# EAGLE design WindHack (EAGLE 7.7.0)
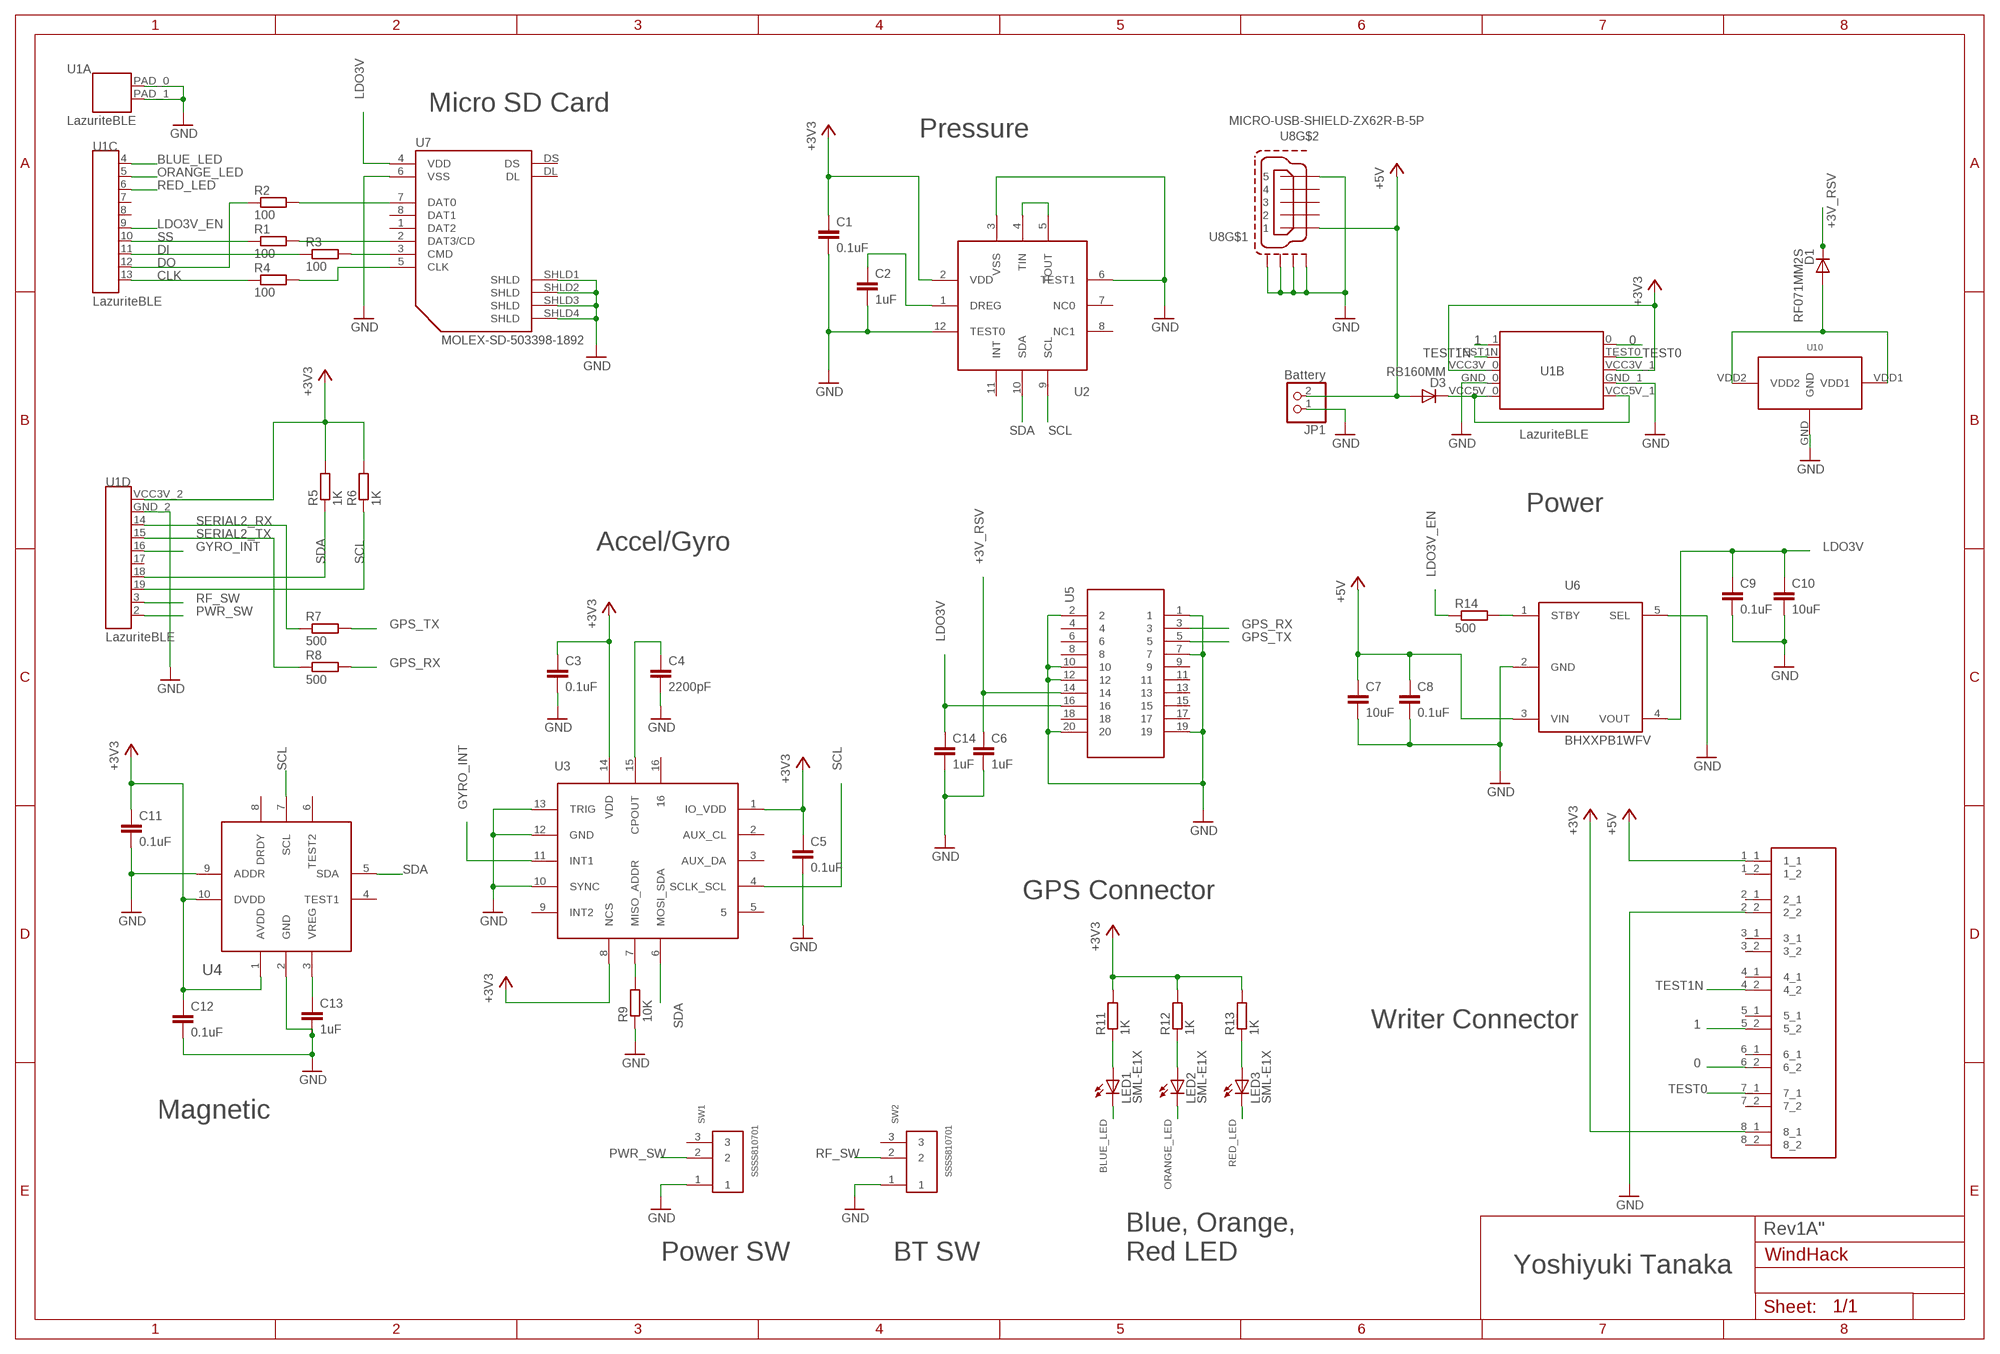
[diagram p0: schematic, sheet 1]

## Parts
C1  0.1uF  C-EUC0603  [C0603]
C2  1uF  C-EUC0603  [C0603]
C3  0.1uF  C-EUC0603  [C0603]
C4  2200pF  C-EUC0603  [C0603]
C5  0.1uF  C-EUC0603  [C0603]
C6  1uF  C-EUC0603  [C0603]
C7  10uF  C-EUC0603  [C0603]
C8  0.1uF  C-EUC0603  [C0603]
C9  0.1uF  C-EUC0603  [C0603]
C10  10uF  C-EUC0603  [C0603]
C11  0.1uF  C-EUC0603  [C0603]
C12  0.1uF  C-EUC0603  [C0603]
C13  1uF  C-EUC0603  [C0603]
C14  1uF  C-EUC0603  [C0603]
D1  RF071MM2S  [RF071MM2S]
D3  RB160MM  [RB160MM-30]
JP1  Battery  PINHD-1X2  [1X02]
LED1  SML-E1X  [SML-E1X]
LED2  SML-E1X  [SML-E1X]
LED3  SML-E1X  [SML-E1X]
R1  100  R-EU_R0603  [R0603]
R2  100  R-EU_R0603  [R0603]
R3  100  R-EU_R0603  [R0603]
R4  100  R-EU_R0603  [R0603]
R5  1K  R-EU_R0603  [R0603]
R6  1K  R-EU_R0603  [R0603]
R7  500  R-EU_R0603  [R0603]
R8  500  R-EU_R0603  [R0603]
R9  10K  R-EU_R0603  [R0603]
R11  1K  R-EU_R0603  [R0603]
R12  1K  R-EU_R0603  [R0603]
R13  1K  R-EU_R0603  [R0603]
R14  500  R-EU_R0603  [R0603]
SW1  SSSS810701  [SSSS810701]
SW2  SSSS810701  [SSSS810701]
U1  LazuriteBLE  LAZURITE920JLAZURITE920J  [LAZURITE920J]
U2  BM1383AGLV  [BM1383AGLV]
U3  KXG03  [KXG03]
U4  BM1422AGMV  [BM1422AGMV]
U5  DF40C-20DS-0.4V  [DF40C-20DS-0.4V]
U6  BHXXPB1WFV  [HVSOF5]
U7  MOLEX-SD-503398-1892  [MOLEX-SD-503398-003]
U8  MICRO-USB-SHIELD-ZX62R-B-5P  [ZX62R-B-5P]
U10  BK-913  [BK-913]
U$1  XB-1-X  [XB-1-X]

## Nets
0: U1.0 U$1.6_2
1: U1.1 U$1.5_2
+3V3: C1.1 C3.1 C5.1 C11.1 C12.1 R5.2 R6.2 R11.2 R12.2 R13.2 U1.VCC3V_0(B:VCC3V_0) U1.VCC3V_1(B:VCC3V_1) U1.VCC3V_2(D:VCC3V_2) U2.2(VDD) U3.1(IO_VDD) U3.8(NCS) U3.14(VDD) U4.1(AVDD) U4.10(DVDD) U$1.8_1
+3V_RSV: C6.1 D1.C U5.14
+5V: C7.1 C8.1 D3.A JP1.2 U6.3(VIN) U8.1 U$1.1_1
BLUE_LED: LED1.C U1.4
CLK: R4.1 U1.13
DI: R3.1 U1.11
DO: R2.1 U1.12
GND: C1.2 C2.2 C3.2 C4.2 C5.2 C6.2 C7.2 C8.2 C9.2 C10.2 C11.2 C12.2 C13.2 C14.2 JP1.1 R9.1 SW1.1 SW2.1 U1.GND_0(B:GND_0) U1.GND_1(B:GND_1) U1.GND_2(D:GND_2) U1.PAD_0(A:PAD_0) U1.PAD_1(A:PAD_1) U2.3(VSS) U2.6(TEST1) U2.12(TEST0) U3.10(SYNC) U3.12(GND) U3.13(TRIG) U4.2(GND) U4.9(ADDR) U5.1 U5.2 U5.7 U5.10 U5.12 U5.19 U5.20 U6.2(GND) U6.5(SEL) U7.6(VSS) U7.SHLD1(SHLD) U7.SHLD2(SHLD) U7.SHLD3(SHLD) U7.SHLD4(SHLD) U8.5 U8.M1(S1) U8.M2(S2) U8.M3(S3) U8.M4(S4) U10.GND U$1.2_2
GPS_RX: R8.2 U5.3
GPS_TX: R7.2 U5.5
GYRO_INT: U1.16 U3.11(INT1)
LDO3V: C9.1 C10.1 C14.1 U5.16 U6.4(VOUT) U7.4(VDD)
LDO3V_EN: R14.1 U1.9
N$1: LED1.A R11.1
N$2: LED2.A R12.1
N$3: U2.4(TIN) U2.5(TOUT)
N$4: LED3.A R13.1
N$5: R9.2 U3.7(MISO_ADDR)
N$6: R14.2 U6.1(STBY)
N$7: C2.1 U2.1(DREG)
N$8: D1.A U10.VDD1 U10.VDD2
N$10: D3.C U1.VCC5V_0(B:VCC5V_0) U1.VCC5V_1(B:VCC5V_1)
N$15: C13.1 U4.3(VREG)
N$16: C4.1 U3.15(CPOUT)
ORANGE_LED: LED2.C U1.5
PWR_SW: SW1.2 U1.2
RED_LED: LED3.C U1.6
RF_SW: SW2.2 U1.3
SCL: R6.1 U1.19 U2.9(SCL) U3.4(SCLK_SCL) U4.7(SCL)
SD_CLK: R4.2 U7.5(CLK)
SD_DI: R3.2 U7.3(CMD)
SD_DO: R2.2 U7.7(DAT0)
SD_SS: R1.2 U7.2(DAT3/CD)
SDA: R5.1 U1.18 U2.10(SDA) U3.6(MOSI_SDA) U4.5(SDA)
SERIAL2_RX: R7.1 U1.14
SERIAL2_TX: R8.1 U1.15
SS: R1.1 U1.10
TEST0: U1.TEST0(B:TEST0) U$1.7_1
TEST1N: U1.TEST1N(B:TEST1N) U$1.4_2
Unconnected: SW1.3 SW2.3 U1.7 U1.8 U1.17 U2.7(NC0) U2.8(NC1) U2.11(INT) U3.2(AUX_CL) U3.3(AUX_DA) U3.5 U3.9(INT2) U3.16 U4.4(TEST1) U4.6(TEST2) U4.8(DRDY) U5.4 U5.6 U5.8 U5.9 U5.11 U5.13 U5.15 U5.17 U5.18 U7.1(DAT2) U7.8(DAT1) U7.DL U7.DS U8.2 U8.3 U8.4 U$1.1_2 U$1.2_1 U$1.3_1 U$1.3_2 U$1.4_1 U$1.5_1 U$1.6_1 U$1.7_2 U$1.8_2

## Notes on the sheet
- Micro SD Card
- Pressure
- Power
- Accel/Gyro
- GPS Connector
- Writer Connector
- Magnetic
- Rev1A''
- Power SW | BT SW
- Blue, Orange, 
  Red LED
- Yoshiyuki Tanaka

## Library data of the parts
C1-C14 = rcl:C-EU: CAPACITOR, European symbol
D1 = lz-shield:RF071MM2S
D3 = lazurite:RB160MM
JP1 = pinhead:PINHD-1X2: PIN HEADER
LED1-LED3 = lazurite:SML-E1X
R1-R9 R11-R14 = rcl:R-EU_: RESISTOR, European symbol
SW1 SW2 = lz-shield:SSSS810701
U1 = lazurite:LAZURITE920J: Lazurite 920J
U2 = lz-shield:BM1383AGLV
U3 = lz-shield:KXG03: Digi-Key品番 1191-1043-1-ND
U4 = lz-shield:BM1422AGMV
U5 = lz-shield:DF40C-20DS-0.4V: Digi-Key品番 H11619CT-ND
U6 = lazurite:BHXXPB1WFV
U7 = molex-custom:MOLEX-SD-503398-1892: Micro SD card holder, push/pull small 8C
U8 = con-hirose:MICRO-USB-SHIELD-: Hirose Micro USB Connector ZX62R-B-5P: Micro B, reverse (top mount) shell SMT Supplier: DigiKey H11574CT-ND Source: http://www.hirose.co.jp/cataloge_hp/e24200011.pdf
U10 = lz-shield:BK-913
U$1 = lz-shield:XB-1-X

## Board
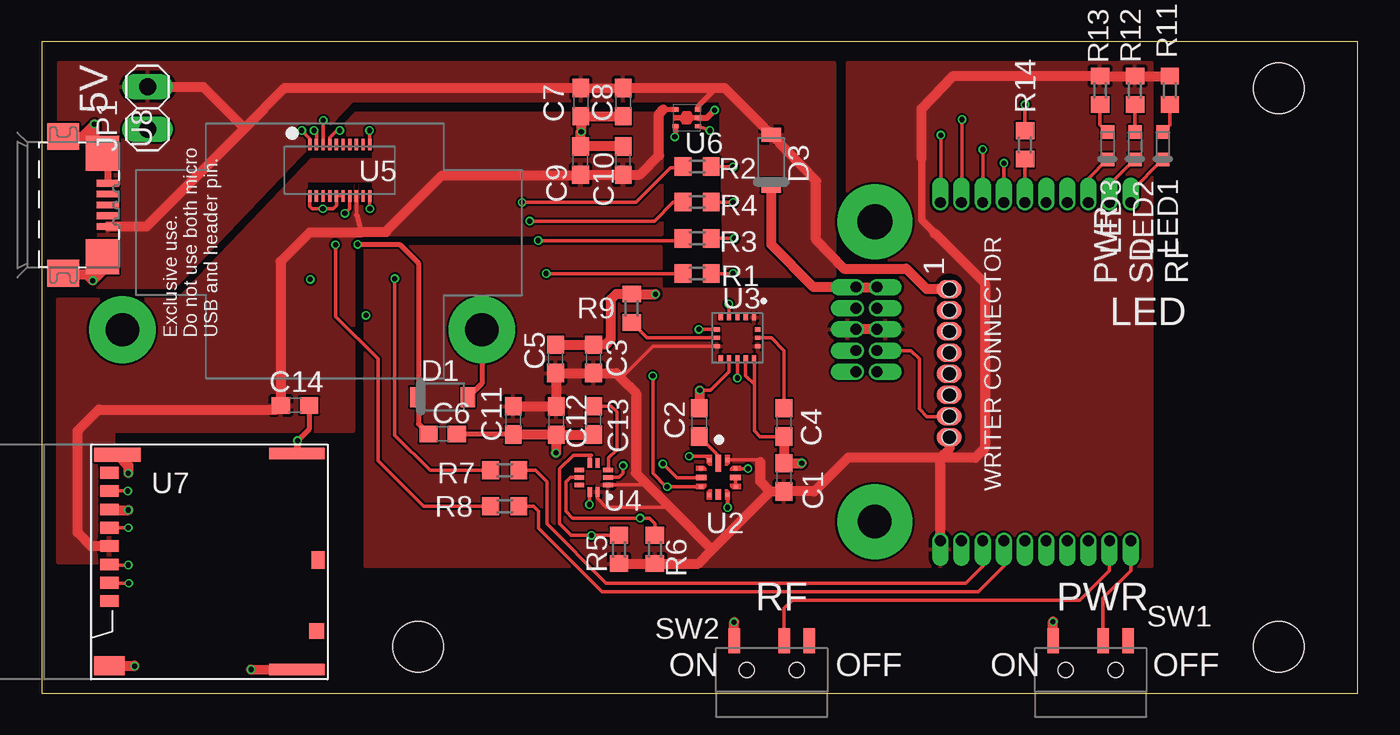
[diagram p1: board, top side]
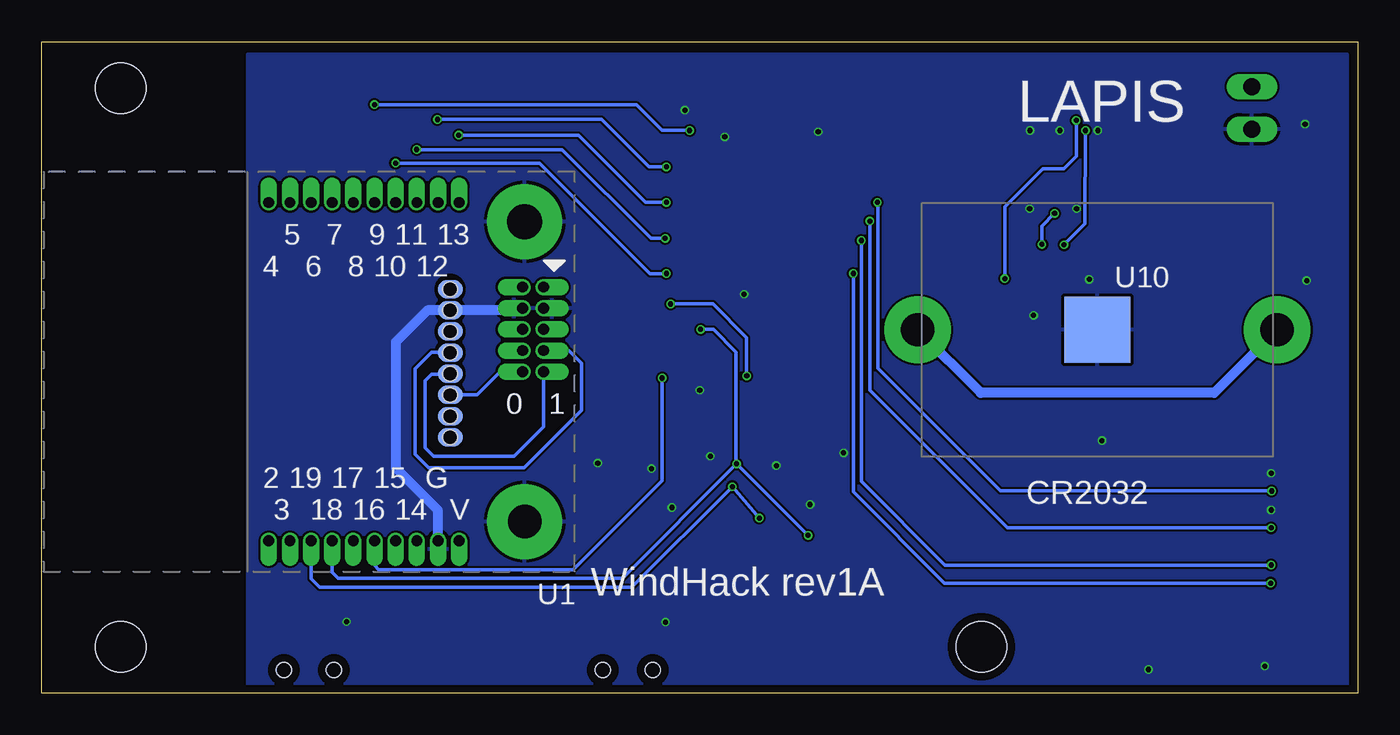
[diagram p2: board, bottom side, seen from below]

Size 79.04 x 39.12 mm. Coordinates in mm from the lower left corner, seen from the top.
Outline: 0,0 79.05,0 79.05,39.12 0,39.12 0,0
Copper layers (1*16): Top 0.018mm / dielectric 1.55mm / Bottom 0.018mm
Design rules "unicraft_2layer": minimum track width 0.125mm, minimum drill 0.25mm, track to track 0.125mm, track to pad 0.125mm, pad to pad 0.125mm, via to via 0.125mm, smd to smd 0mil, copper to edge 0.5mm, drill to drill 0.3mm, minimum pad ring 0.175mm, minimum via ring 0.1mm, stop-mask expansion 0mil, vias tented up to drill 0.45mm, thermal gap 0.2mm
Holes 3 mm at 74.3,36.32 74.3,2.79 22.61,2.79

### Footprints (pad centres in the part's own frame; a part is rotated, then mirrored left to right if it is on the bottom)
C0603 = smd 1.1 x 1: 1 -0.85,0; 2 0.85,0
RF071MM2S = smd 1.2 x 0.85: A 0,1.525; C 0,-1.525
RB160MM-30 = smd 1.2 x 0.85: A 0,1.525; C 0,-1.525
1X02 = drill 1.016 long: 1 -1.27,0; 2 1.27,0
SML-E1X = smd 0.8 x 0.8: A 0,-0.825; C 0,0.825
R0603 = smd 1 x 1.1: 1 -0.85,0; 2 0.85,0
SSSS810701 = smd 0.7 x 1.5: 1 -2.25,1.75; 2 0.75,1.75; 3 2.25,1.75 | hole 0.9: 1.5,0; -1.5,0
LAZURITE920J = drill 0.65 pad 0.8 offset: 0 1.27,5.08; 1 0,5.08; 2 16.51,15.24; 3 15.24,15.24; 4 16.51,-5.08; 5 15.24,-5.08; 6 13.97,-5.08; 7 12.7,-5.08; 8 11.43,-5.08; 9 10.16,-5.08; 10 8.89,-5.08; 11 7.62,-5.08; 12 6.35,-5.08; 13 5.08,-5.08; 14 7.62,15.24; 15 8.89,15.24; 16 10.16,15.24; 17 11.43,15.24; 18 12.7,15.24; 19 13.97,15.24; GND_0 0,1.27; GND_1 1.27,1.27; GND_2 6.35,15.24; TEST0 1.27,3.81; TEST1N 0,3.81; VCC3V_0 0,2.54; VCC3V_1 1.27,2.54; VCC3V_2 5.08,15.24; VCC5V_0 0,0; VCC5V_1 1.27,0 | drill 2.1 pad 4.5: PAD_0 1.135,-3.92 | drill 2 pad 4.5: PAD_1 1.135,14.08
BM1383AGLV = smd 1 x 0.32: 1 -0.85,0 | smd 0.25 x 0.25: 2 -1.05,0.555; 3 -0.55,1.035; 5 0.555,1.05; 6 1.035,0.55; 8 1.05,-0.555; 9 0.55,-1.035; 11 -0.555,-1.05; 12 -1.035,-0.55 | smd 0.32 x 0.65: 4 0,1.025; 10 0,-1.025 | smd 0.65 x 0.32: 7 1.025,0
KXG03 = smd 0.35 x 0.25: 1 -1.225,1; 2 -1.225,0.5; 3 -1.225,0; 4 -1.225,-0.5; 5 -1.225,-1; 9 1.225,-1; 10 1.225,-0.5; 11 1.225,0; 12 1.225,0.5; 13 1.225,1 | smd 0.25 x 0.35: 6 -0.5,-1.225; 7 0,-1.225; 8 0.5,-1.225; 14 0.5,1.225; 15 0,1.225; 16 -0.5,1.225
BM1422AGMV = smd 0.25 x 0.58: 1 0.45,0.865; 2 0,0.865; 3 -0.45,0.865; 6 -0.45,-0.865; 7 0,-0.865; 8 0.45,-0.865 | smd 0.58 x 0.25: 4 -0.865,0.23; 5 -0.865,-0.23; 9 0.865,-0.23; 10 0.865,0.23
DF40C-20DS-0.4V = smd 0.2 x 0.7: 1 1.8,-1.54; 2 1.8,1.54; 3 1.4,-1.54; 4 1.4,1.54; 5 1,-1.54; 6 1,1.54; 7 0.6,-1.54; 8 0.6,1.54; 9 0.2,-1.54; 10 0.2,1.54; 11 -0.2,-1.54; 12 -0.2,1.54; 13 -0.6,-1.54; 14 -0.6,1.54; 15 -1,-1.54; 16 -1,1.54; 17 -1.4,-1.54; 18 -1.4,1.54; 19 -1.8,-1.54; 20 -1.8,1.54
HVSOF5 = smd 0.25 x 0.35: 1 0.5,0.675; 2 0,0.675; 3 -0.5,0.675; 4 -0.5,-0.675; 5 0.5,-0.675
MOLEX-SD-503398-003 = smd 0.7 x 1.1: 1 -7.7,0; 2 -6.6,0; 3 -5.5,0; 4 -4.4,0; 5 -3.3,0; 6 -2.2,0; 7 -1.1,0; 8 0,0 | smd 0.93 x 0.9: DL -9.49,-12.465 | smd 1.05 x 0.78: DS -5.225,-12.54 | smd 0.86 x 2.8: SHLD1 1.08,-0.5 | smd 1.14 x 1.83: SHLD2 -11.58,-0.015 | smd 0.7 x 3.33: SHLD3 1.16,-11.265; SHLD4 -11.8,-11.265
ZX62R-B-5P = smd 1.35 x 0.4: 1 2.675,-1.3; 2 2.675,-0.65; 3 2.675,0; 4 2.675,0.65; 5 2.675,1.3 | smd 1.9 x 1.6: M1 0,-4.1; M2 0,4.1 | smd 2 x 2.1: M3 2.35,3.1; M4 2.35,-3.1
BK-913 = smd 3.96 x 3.96: GND 0,0 | drill 2 pad 4: VDD1 -10.8,0; VDD2 10.79,0
XB-1-X = smd 1.1 x 1.5: 1_1 -5.08,0; 2_1 -3.81,0; 3_1 -2.54,0; 4_1 -1.27,0; 5_1 0,0; 6_1 1.27,0; 7_1 2.54,0; 8_1 3.81,0 | smd 1.1 x 1.5 bottom: 1_2 -5.08,0; 2_2 -3.81,0; 3_2 -2.54,0; 4_2 -1.27,0; 5_2 0,0; 6_2 1.27,0; 7_2 2.54,0; 8_2 3.81,0 | hole 0.85: -5.08,0; -3.81,0; -2.54,0; -1.27,0; 0,0; 1.27,0; 2.54,0; 3.81,0

### Placement (x,y rotation side)
C1  44.58,12.95 90 top
C2  39.5,16.26 90 top
C3  33.15,20.07 90 top
C4  44.58,16.26 270 top
C5  30.86,20.07 90 top
C6  24.09,15.56 0 top
C7  32.39,35.48 270 top
C8  34.93,35.48 270 top
C9  32.36,31.98 90 top
C10  34.93,31.98 90 top
C11  28.32,16.38 270 top
C12  30.9,16.36 270 top
C13  33.15,16.38 270 top
C14  15.21,17.27 0 top
D1  24.07,17.78 270 top
D3  43.82,32 0 top
JP1  6.36,35.13 90 top
LED1  67.34,32.87 180 top
LED2  65.66,32.87 180 top
LED3  64.01,32.87 180 top
R1  39.37,25.2 180 top
R2  39.37,31.62 180 top
R3  39.37,27.3 180 top
R4  39.37,29.49 180 top
R5  34.67,8.64 270 top
R6  36.83,8.64 270 top
R7  27.81,13.39 180 top
R8  27.81,11.23 180 top
R9  35.43,23.11 270 top
R11  67.75,36.2 90 top
R12  65.66,36.2 90 top
R13  63.56,36.2 90 top
R14  59.06,32.92 90 top
SW1  62.99,1.4 0 top
SW2  43.84,1.4 0 top
U1  48.9,24.38 180 bottom
U2  40.64,12.95 270 top
U3  41.78,21.34 270 top
U4  33.15,12.95 270 top
U5  17.91,31.39 180 top
U6  38.73,34.54 270 top
U7  4.06,13.23 90 top
U8  1.3,29.31 0 top
U10  15.65,21.82 180 bottom
U$1  54.51,19.18 270 top

### Tracks (layer width: path | path; a pad name or v marks a point on that pad's centre or on a via)
0
  Bottom 0.203: U1.0 51.51,19.3 52.91,17.91 U$1.6_2
1
  Bottom 0.203: U1.1 48.9,16 50.67,14.22 55.5,14.22 56.01,14.73 56.01,18.77 55.63,19.15 54.53,19.15 U$1.5_2
+3V3
  Top 0.203: U4.1 36.39,12.5 36.45,12.45 | U4.10 33.38,11.71 33.91,11.18 37.72,11.18 37.85,11.05 | U2.2 43.02,14 43.16,13.87 | U3.8 36.71,20.84 34.8,18.92
  Top 0.406: 52.86,28.93 52.86,32.13
  Top 0.457: 52.86,28.93 52.86,28.4 53.64,27.61 54.46,26.8
  Top 0.61: 52.86,32.13 52.86,35.1 54.74,37.06 63.55,37.06 R13.2 R12.2 R11.2 | U1.VCC3V_1 U1.VCC3V_0 | U1.VCC3V_2 53.98,14.12 | C11.1 28.34,17.21 C12.1 30.9,19.18 C5.1 C3.1 34.51,19.22 34.8,18.92 35.69,18.03 35.69,13.21 36.45,12.45 37.85,11.05 40.27,8.62 | 43.75,12.1 C1.1 44.59,12.12 46.41,12.12 48.41,14.12 53.98,14.12 | 43.75,12.1 43.16,12.7 43.16,13.87 | 53.64,27.61 56.64,24.61 56.64,14.71 56.06,14.12 53.98,14.12 | U$1.8_1 54.51,14.66 53.98,14.12 | R5.2 R6.2 39.43,7.79 40.27,8.62 | 40.27,8.62 43.75,12.1
  pour Top: 48.39,24.26 48.39,37.85 66.67,37.85 66.67,7.62 19.43,7.62 19.43,26.8 37.21,26.8 37.21,24.26
+3V_RSV  (via drill 0.3)
  Top 0.203: U5.14 18.51,29.1 v18.21,28.8
  Top 0.305: v18.97,26.95 21.49,26.95 22.63,25.81 22.63,17.78 | 22.63,17.78 22.63,16.17 C6.1 | D1.C 22.63,17.78
  Bottom 0.203: v18.21,28.8 18.97,28.04 v18.97,26.95
+5V
  Top 0.305: U6.3 39.41,35.23 40.51,36.33
  Top 0.61: U8.1 6.29,28.02 12.19,33.91 | U$1.1_1 53.16,24.26 51.93,25.49 48.17,25.49 46.51,27.23 46.51,30.76 D3.A 41.01,36.33 40.51,36.33 C8.1 32.39,36.32 C7.1 14.61,36.33 12.19,33.91 | JP1.2 9.7,36.4 12.19,33.91
  pour Top: 1.02,37.85 47.62,37.85 47.62,25.02 41.02,25.02 40.77,35.56 18.67,35.56 8,24.38 1.02,24.38
BLUE_LED
  Top 0.203: U1.4 65.41,30.11 LED1.C
CLK  (via drill 0.3)
  Top 0.203: U1.13 54,29.49 v54,33.5 | R4.1 v41.53,29.46
  Bottom 0.203: v54,33.5 46.79,33.5 42.77,29.49 41.55,29.49 v41.53,29.46
DI  (via drill 0.3)
  Top 0.203: U1.11 v56.52,32.64 | R3.1 v41.61,27.3
  Bottom 0.203: v41.61,27.3 42.44,27.3 47.78,32.64 v56.52,32.64
DO  (via drill 0.3)
  Top 0.203: U1.12 55.27,29.49 v55.27,34.44 | R2.1 v41.53,31.6
  Bottom 0.203: v55.27,34.44 45.41,34.44 42.57,31.6 v41.53,31.6
GND  (via drill 0.3)
  Top 0.203: U4.9 v32.89,11.33 | U5.19 19.69,32.96 v19.69,33.78 | U5.1 16.11,33.3 v15.62,33.78 | U5.7 17.31,33.33 17.76,33.78 v17.91,33.78 | U5.2 16.11,29.23 16.26,29.08 v16.89,29.08 17.5,29.08 17.7,29.29 U5.10 U5.12 | U5.20 v19.71,29.08 | v34.93,13.66 34.93,13.21 34.67,12.95 U4.2 | v38.89,14.22 39.86,14.22 U2.12 | 39.5,18.16 v39.52,18.19 40.16,18.19 41.28,19.3 41.28,20.1 U3.10 | U3.13 42.8,20.09 42.8,18.54 | 42.8,18.54 42.8,15.75 43.14,15.41 C4.2 | U3.12 42.28,19.06 42.8,18.54
  Top 0.254: U2.3 v42.42,13.49 | U2.6 v41.2,11.15
  Top 0.305: U6.5 38.06,33.44 v38.02,33.4 | 32.35,32.84 C9.2 | C6.2 28.29,15.56 C11.2 | C14.2 16.06,15.86 v15.37,15.16
  Top 0.356: U6.2 39.95,34.54 v40.41,35
  Top 0.406: v15.37,15.16 U7.SHLD3 | 3.97,32.17 U8.5
  Top 0.61: C8.2 C7.2 32.39,33.73 v32.41,33.71 32.36,33.66 C9.2 C10.2 | C5.2 C3.2 | C3.2 33.19,20.95 33.24,20.9 | C4.2 C1.2 45.63,13.8 v45.64,13.82 | v36.86,23.95 35.45,23.95 R9.1 34.51,23.96 34.16,23.62 34.16,21.21 33.88,20.93 33.16,20.93 C3.2 | C11.2 30.88,15.53 C12.2 | C12.2 33.13,15.51 C13.2 | 4.53,14.35 U7.SHLD1 5.21,13.67 v5.21,13.21 | C12.2 30.9,14.44 v30.89,14.43 | U7.SHLD2 5.56,1.65 v5.59,1.63 | U7.6 4.1,11 v5.21,11 | C2.2 39.52,17.13 v39.52,18.19 | v12.57,1.42 U7.SHLD4 | SW2.1 v41.58,4.27 | SW1.1 v60.73,4.29 | U8.M1 1.36,25.15 2.69,25.15 v3.07,24.77 3.65,25.34 U8.M4 | U8.M2 2.42,33.41 v3.18,34.16 3.18,32.88 U8.M3 4.18,32.38 3.97,32.17
  Bottom 0.61: U1.GND_2 55.27,9.17 55.27,11.02 57.78,13.54 57.78,21.08 55.88,22.99 U$1.2_2 50.29,22.99 U1.GND_1
  other vias: 19.48,22.68 16.13,24.84
  pour Bottom: 0.63,38.35 66.67,38.35 66.67,0.51 0.63,0.51
GPS_RX  (via drill 0.3)
  Top 0.203: U5.3 16.51,33.66 v16.36,33.78 | v17.65,26.92 17.65,22.61 20.19,20.07 20.19,13.97 22.94,11.23 R8.2
  Bottom 0.203: v17.65,26.92 16.38,28.19 v16.36,33.78
GPS_TX  (via drill 0.3)
  Top 0.203: v16.92,34.39 16.92,32.94 U5.5 | v21.21,24.89 21.21,15.49 23.32,13.39 R7.2
  Bottom 0.203: v21.21,24.89 21.21,29.21 18.92,31.5 17.65,31.5 16.92,32.23 v16.92,34.39
GYRO_INT  (via drill 0.3)
  Top 0.203: v41.78,18.92 U3.11
  Bottom 0.203: U1.16 59.06,7.67 58.8,7.42 47.12,7.42 41.78,12.75 v41.78,18.92
LDO3V
  Top 0.203: U5.16 18.91,28.72
  Top 0.305: 37.33,35.04 U6.4 | 18.91,28.72 19.18,27.69
  Top 0.61: 37.33,35.04 37.08,34.8 37.08,32.28 35.93,31.13 C10.1 C9.1 32.32,31.09 24.05,31.09 20.7,27.74 20.7,27.69 19.18,27.69 19.16,27.67 16.12,27.67 14.35,25.91 14.35,17.29 C14.1 14.11,17.02 3.43,17.02 2.16,15.75 2.16,9.65 2.98,8.83 U7.4
  pour Top: 1.02,23.62 8.26,23.62 18.92,34.8 37.19,34.8 37.21,27.56 18.67,27.56 18.67,15.75 4.27,15.75 4.19,7.87 1.02,7.87
LDO3V_EN
  Top 0.203: R14.1 59.49,32.07 59.42,32 59.06,32 U1.9
N$1
  Top 0.203: R11.1 67.75,34.11 LED1.A
N$2
  Top 0.203: R12.1 LED2.A
N$3
  Top 0.203: U2.4 41.66,12.42 U2.5
N$4
  Top 0.203: R13.1 63.56,34.14 LED3.A
N$5
  Top 0.203: R9.2 36.36,21.34 U3.7
N$6  (via drill 0.3)
  Top 0.203: U6.1 v40.12,33.79 v40.13,33.78 | v59.06,35.33 R14.2
  Bottom 0.203: v59.06,35.33 43.33,35.33 41.78,33.78 v40.13,33.78
N$7
  Top 0.203: C2.1 40.64,14.26 U2.1
N$8
  Top 0.203: D1.A 25.61,17.78
  Top 0.305: U10.VDD2 26.44,18.61 25.61,17.78
  Bottom 0.61: U10.VDD1 8.63,18.03 22.65,18.03 U10.VDD2
N$10
  Top 0.61: U1.VCC5V_1 U1.VCC5V_0 46.36,24.38 43.82,26.92 D3.C
N$15
  Top 0.203: 32.89,17.49 C13.1 34.2,17.23 34.54,16.89 34.54,14.63 34.04,14.12 34.04,13.43 U4.3
N$16
  Top 0.203: 44.56,17.55 C4.1 44.58,20.57 43.82,21.34 U3.15
ORANGE_LED
  Top 0.203: U1.5 64.14,30.52 LED2.C
PWR_SW
  Top 0.203: SW1.2 63.74,5.7 65.41,7.37 U1.2
RED_LED
  Top 0.203: U1.6 62.87,30.9 LED3.C
RF_SW
  Top 0.203: SW2.2 44.59,5.09 45.09,5.59 62.36,5.59 64.14,7.37 U1.3
SCL  (via drill 0.3)
  Top 0.203: U4.7 31.75,12.95 31.5,12.7 31.5,10.92 31.88,10.52 v35.94,10.52 36.5,10.52 36.83,10.18 R6.1 | U2.9 v37.56,12.4 | v36.7,19.05 36.7,13.21 37.51,12.4 v37.56,12.4 | v37.56,12.4 v37.57,12.39 | U3.4 v41.28,23.37
  Bottom 0.203: U1.19 62.87,6.86 62.36,6.35 43.61,6.35 v37.57,12.39 v35.94,10.52 | v36.7,19.05 36.7,21.34 38.73,23.37 v41.28,23.37
SD_CLK  (via drill 0.3)
  Top 0.203: U7.5 v5.21,9.93 | R4.2 38.71,29.49 38.73,29.46 37.92,29.46 36.8,28.35 v29.31,28.35
  Bottom 0.203: v29.31,28.35 29.31,18.19 21.06,9.93 v5.21,9.93
SD_DI  (via drill 0.3)
  Top 0.203: U7.3 4.1,7.7 v5.21,7.7 | R3.2 38.24,27.03 38.33,27.03 38.48,27.18 v29.82,27.18
  Bottom 0.203: v29.82,27.18 29.82,12.72 24.79,7.7 v5.21,7.7
SD_DO  (via drill 0.3)
  Top 0.203: U7.7 v5.18,12.14 | R2.2 38.25,31.55 37.77,31.55 35.69,29.46 v28.85,29.46
  Bottom 0.203: v28.85,29.46 28.83,29.44 28.83,19.51 21.46,12.14 v5.18,12.14
SD_SS  (via drill 0.3)
  Top 0.203: U7.2 4.09,6.6 v5.23,6.6 | v30.3,25.2 R1.2
  Bottom 0.203: v30.3,25.2 30.3,12.09 24.82,6.6 v5.23,6.6
SDA  (via drill 0.3)
  Top 0.203: U4.5 32.92,14.15 33.02,14.3 31.95,14.3 31.12,13.46 31.12,10.16 31.8,9.47 v33.02,9.47 33.03,9.49 R5.1 | U2.10 39.59,12.93 38.15,12.93 v37.31,13.77 | U3.6 v39.47,21.84
  Bottom 0.203: U1.18 61.59,7.26 61.24,6.91 44.17,6.91 v37.31,13.77 | v37.31,13.77 v33.02,9.47 | v39.47,21.84 38.71,21.84 37.34,20.47 37.34,13.79 v37.31,13.77
SERIAL2_RX
  Top 0.203: R7.1 29.67,13.39 30.35,12.7 30.35,10.16 33.91,6.6 55.5,6.6 56.52,7.62 U1.14
SERIAL2_TX
  Top 0.203: 28.66,11.11 R8.1 29.54,11.23 29.84,10.92 29.84,9.91 33.66,6.1 56.26,6.1 57.78,7.62 U1.15
SS  (via drill 0.3)
  Top 0.203: U1.10 v57.78,31.83 | R1.1 v41.53,25.2
  Bottom 0.203: v41.53,25.2 41.55,25.17 42.49,25.17 49.15,31.83 v57.78,31.83
TEST0
  Top 0.203: U1.TEST0 52.2,20.57 52.7,20.07 52.7,17.07 53.16,16.61 54.48,16.61 U$1.7_1
TEST1N
  Bottom 0.203: U1.TEST1N 47.37,20.57 46.61,19.81 46.61,16.99 50.06,13.54 55.8,13.54 56.62,14.35 56.62,19.48 55.63,20.47 54.53,20.47 U$1.4_2

### Text on the board
tPlace: 5V | 1 | PWR / SD / RF | LED | Exclusive use. / Do not use both micro / USB and header pin. | WRITER CONNECTOR | RF | PWR | ON | OFF | ON | OFF
bPlace: LAPIS | CR2032 | WindHack rev1A